# EAGLE design PowerIR-v11 (EAGLE 5.10)
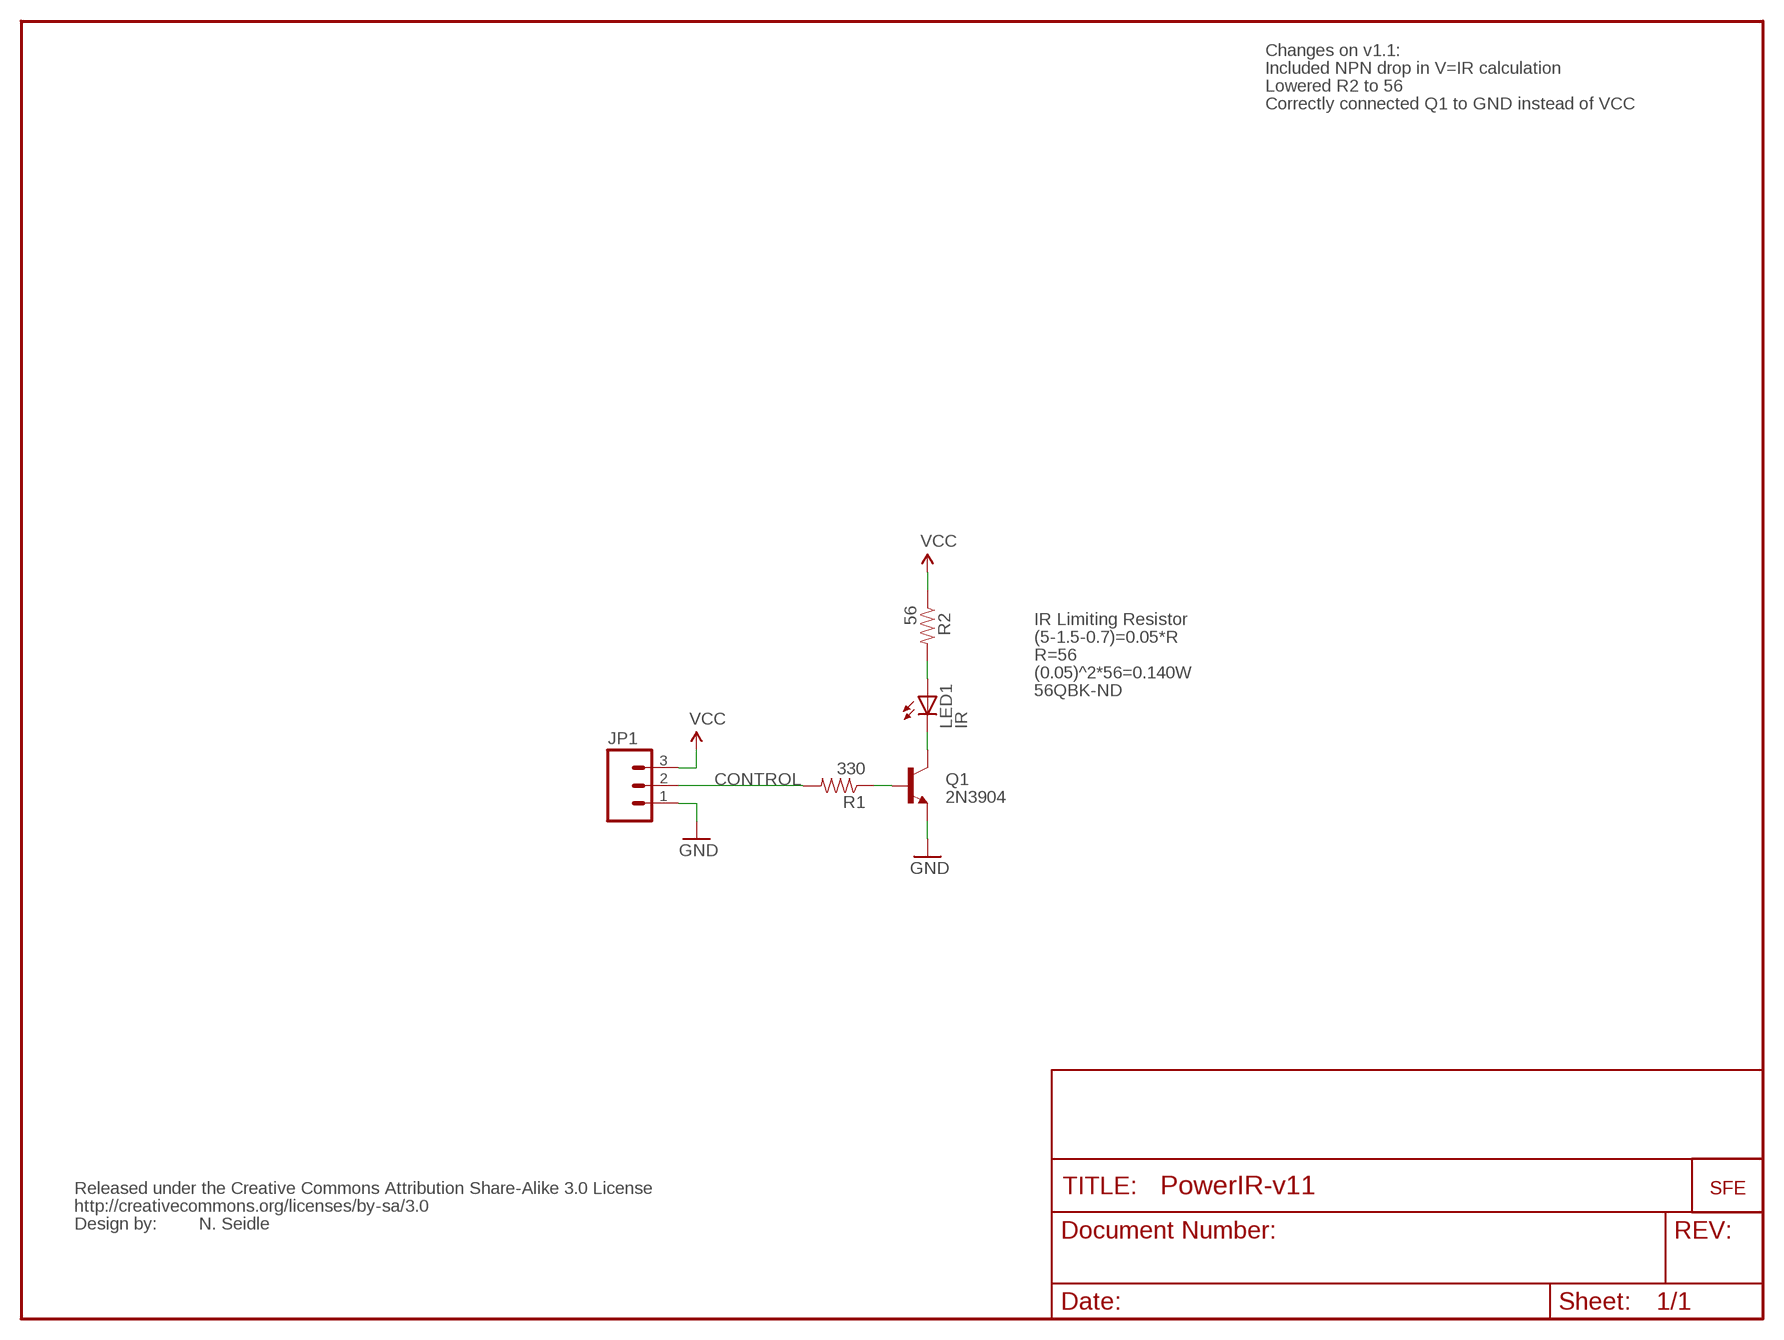
[diagram p0: schematic, sheet 1]

## Parts
JP1  M03PTH  [1X03]
LED1  IR  LED5MM  [LED5MM]
Q1  2N3904  TRANSISTOR_NPNTO92  [TO-92]
R1  330  RESISTORAXIAL-0.3  [AXIAL-0.3]
R2  56  RESISTORAXIAL-0.3  [AXIAL-0.3]
U$1  LOGO-SFESK  [SFE-LOGO-FLAME]
U$3  CREATIVE_COMMONS  [CREATIVE_COMMONS]

## Nets
CONTROL: JP1.2 R1.P$2
GND: JP1.1 Q1.1(E)
N$1: LED1.K(C) Q1.3(C)
N$2: Q1.2(B) R1.P$1
N$5: LED1.A R2.P$2
VCC [vcc]: JP1.3 R2.P$1

## Notes on the sheet
- Changes on v1.1:
- Included NPN drop in V=IR calculation
- Lowered R2 to 56
- Correctly connected Q1 to GND instead of VCC
- IR Limiting Resistor
- (5-1.5-0.7)=0.05*R
- R=56
- (0.05)^2*56=0.140W
- 56QBK-ND
- N. Seidle

## Library data of the parts
JP1 = SparkFun:M03: Header 3 Standard 3-pin 0.1" header. Use with straight break away headers (SKU : PRT-00116), right angle break away headers (PRT-00553), swiss pins (PRT-00743), machine pins (PRT-00117), and female headers (PRT-00115). Molex polarized connector foot print use with SKU : PRT-08232 with associated crimp pins and housings.
LED1 = SparkFun:LED: LEDs Standard schematic elements and footprints for 5mm, 3mm, 1206, and 0603 sized LEDs. 5mm - Spark Fun Electronics SKU : COM-00529 (and others)
Q1 = SparkFun:TRANSISTOR_NPN: Transistor NPN BJT configuration in SOT23 package. MMBT2222 is the common NPN we use. Double check BCE configuration again layout.
R1 R2 = SparkFun:RESISTOR: Resistor Basic schematic elements and footprints for 0603, 1206, and PTH resistors.
U$1 = SparkFun:LOGO-SFE: Spark Fun Electronics PCB Logo This is the standard Spark Fun Electronics PCB logo.
U$3 = SparkFun:CREATIVE_COMMONS

## Net classes
1 vcc: width 0.254 mm

## Board
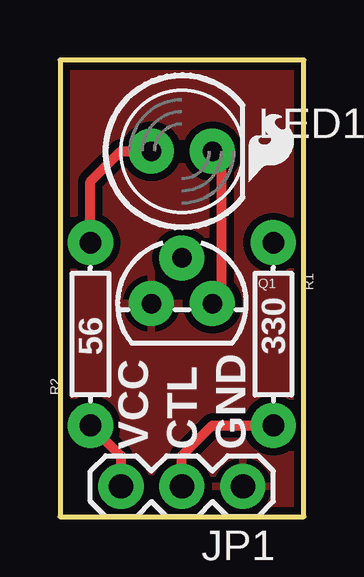
[diagram p1: board, top side]
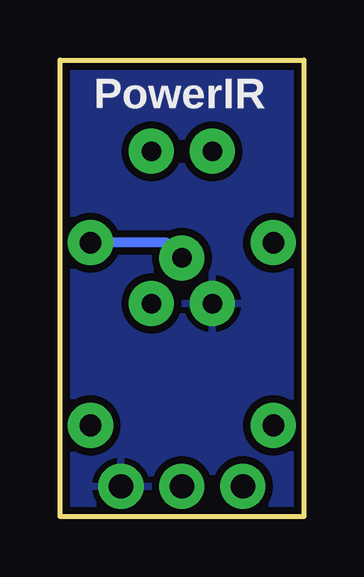
[diagram p2: board, bottom side, seen from below]

Size 10.16 x 19.05 mm. Coordinates in mm from the lower left corner, seen from the top.
Outline: 10.16,0 10.16,19.05 0,19.05 0,0 10.16,0
Copper layers (1*16): Top 0.035mm / dielectric 1.5mm / Bottom 0.035mm
Design rules "SparkFun *": minimum track width 10mil, minimum drill 20mil, track to track 8mil, track to pad 8mil, pad to pad 8mil, via to via 8mil, smd to smd 8mil, copper to edge 10mil, drill to drill 8mil, minimum pad ring 12mil, minimum via ring 10mil, stop-mask expansion 4mil, vias tented up to drill 25mil, thermal gap 10mil

### Footprints (pad centres in the part's own frame; a part is rotated, then mirrored left to right if it is on the bottom)
1X03 = drill 1.016 pad 1.88 round: 1 0,0; 2 2.54,0; 3 5.08,0
LED5MM = drill 0.813 pad 1.88 round: A -1.27,0; K 1.27,0
TO-92 = drill 0.813 pad 1.88 round: 1 -1.27,0; 2 0,1.905; 3 1.27,0
AXIAL-0.3 = drill 0.9 pad 1.88 round: P$1 -3.81,0; P$2 3.81,0

### Placement (x,y rotation side)
JP1  7.62,1.27 180 top
LED1  5.08,15.24 0 top
Q1  5.08,8.89 0 top
R1  8.89,7.62 270 top
R2  1.27,7.62 90 top
U$1  7.87,13.97 0 top
U$3  5.08,-8.89 0 top  (outside the outline)

### Tracks (layer width: path | path; a pad name or v marks a point on that pad's centre or on a via)
CONTROL
  Top 0.406: R1.P$2 6.35,3.81 5.08,2.54 JP1.2
GND
  pour Top (isolate 0.305): 0,0 0,19.05 10.16,19.05 10.16,0
  pour Bottom (isolate 0.305): 0,0 0,19.05 10.16,19.05 10.16,0
N$1
  Top 0.406: LED1.K 6.73,14.86 6.73,9.27 Q1.3
N$2
  Bottom 0.406: R1.P$1 5.71,11.43 Q1.2
N$5
  Top 0.406: R2.P$2 1.27,13.97 2.54,15.24 LED1.A
VCC
  Top 0.406: JP1.3 2.54,2.54 R2.P$1

### Text on the board
tPlace: VCC | CTL | GND | N. Seidle
bPlace: PowerIR